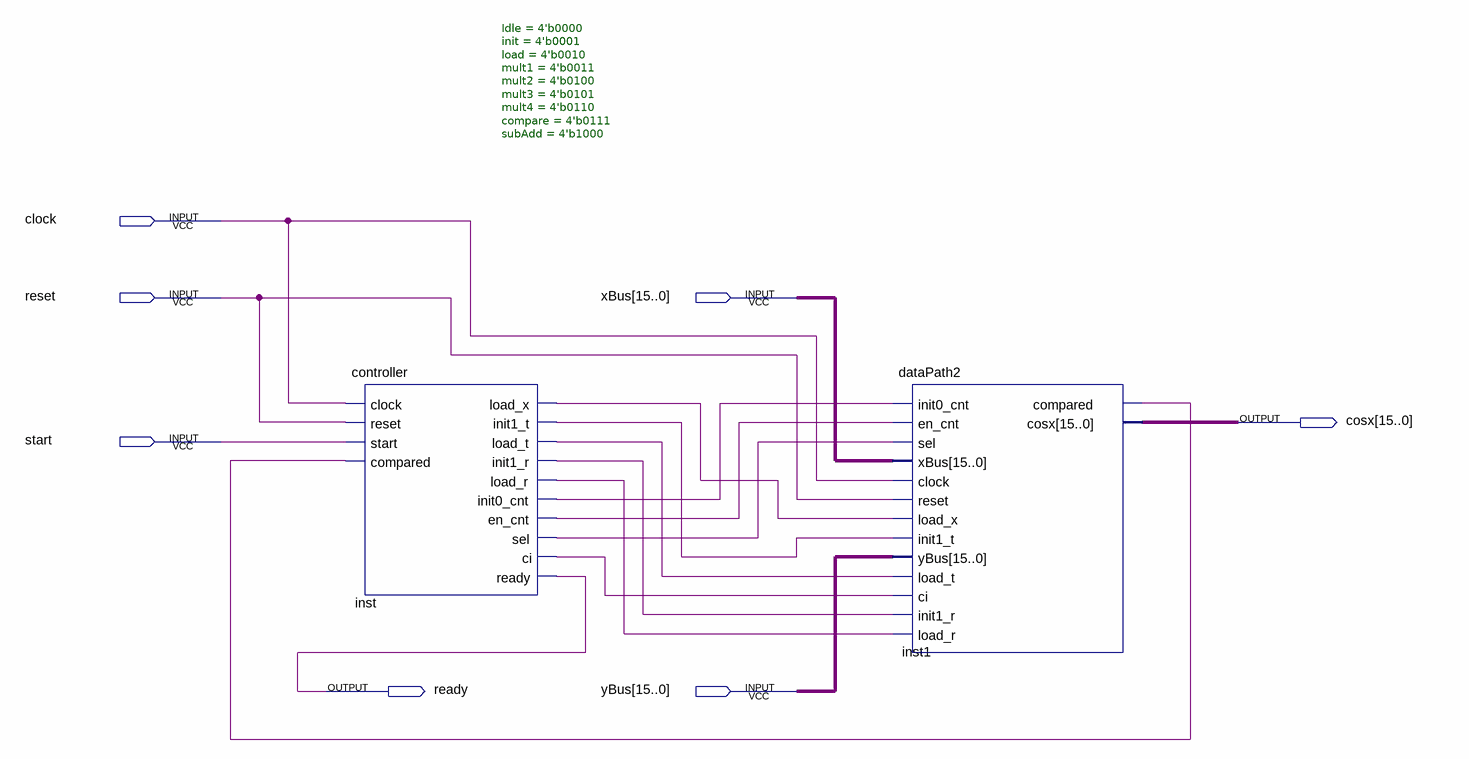
[diagram p0: schematic sheet]
// Quartus schematic cosx.bdf as structural Verilog: 2 symbols, 7 pins
module cosx (
  input  clock,
  input  reset,
  input  [15:0] xBus,
  input  start,
  input  [15:0] yBus,
  output [15:0] cosx,
  output ready
);

  wire inst1_compared, inst_ci, inst_en_cnt, inst_init0_cnt, inst_init1_r, inst_init1_t, inst_load_r,
       inst_load_t, inst_load_x, inst_sel;

  controller #(.Idle(4'b0000), .init(4'b0001), .load(4'b0010), .mult1(4'b0011), .mult2(4'b0100), .mult3(4'b0101), .mult4(4'b0110), .compare(4'b0111), .subAdd(4'b1000)) inst (
    .clock(clock), .reset(reset), .start(start), .compared(inst1_compared), .load_x(inst_load_x),
    .init1_t(inst_init1_t), .load_t(inst_load_t), .init1_r(inst_init1_r), .load_r(inst_load_r),
    .init0_cnt(inst_init0_cnt), .en_cnt(inst_en_cnt), .sel(inst_sel), .ci(inst_ci), .ready(ready));
  dataPath2 inst1 (
    .init0_cnt(inst_init0_cnt), .en_cnt(inst_en_cnt), .sel(inst_sel), .xBus(xBus), .clock(clock),
    .reset(reset), .load_x(inst_load_x), .init1_t(inst_init1_t), .yBus(yBus), .load_t(inst_load_t),
    .ci(inst_ci), .init1_r(inst_init1_r), .load_r(inst_load_r), .compared(inst1_compared), .cosx(cosx));
endmodule
